# EAGLE design Brake (EAGLE 6.3)
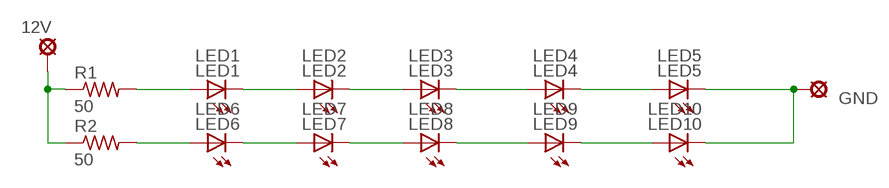
[diagram p0: schematic, sheet 1]

## Parts
12V  LSP13  [LSP13]
GND  LSP13  [LSP13]
LED1  LED1  LED-2AC-CP41B-WES  [CP41B]
LED2  LED2  LED-2AC-CP41B-WES  [CP41B]
LED3  LED3  LED-2AC-CP41B-WES  [CP41B]
LED4  LED4  LED-2AC-CP41B-WES  [CP41B]
LED5  LED5  LED-2AC-CP41B-WES  [CP41B]
LED6  LED6  LED-2AC-CP41B-WES  [CP41B]
LED7  LED7  LED-2AC-CP41B-WES  [CP41B]
LED8  LED8  LED-2AC-CP41B-WES  [CP41B]
LED9  LED9  LED-2AC-CP41B-WES  [CP41B]
LED10  LED10  LED-2AC-CP41B-WES  [CP41B]
R1  50  R-US_R1206  [R1206]
R2  50  R-US_R1206  [R1206]

## Nets
GND: GND.MP LED5.1(C) LED5.4(C) LED10.1(C) LED10.4(C)
N$1: LED1.2(A) LED1.3(A) R1.2
N$2: LED1.1(C) LED1.4(C) LED2.2(A) LED2.3(A)
N$3: LED2.1(C) LED2.4(C) LED3.2(A) LED3.3(A)
N$4: LED3.1(C) LED3.4(C) LED4.2(A) LED4.3(A)
N$5: LED4.1(C) LED4.4(C) LED5.2(A) LED5.3(A)
N$6: LED6.2(A) LED6.3(A) R2.2
N$7: LED6.1(C) LED6.4(C) LED7.2(A) LED7.3(A)
N$8: LED7.1(C) LED7.4(C) LED8.2(A) LED8.3(A)
N$9: 12V.MP R1.1 R2.1
N$10: LED8.1(C) LED8.4(C) LED9.2(A) LED9.3(A)
N$11: LED9.1(C) LED9.4(C) LED10.2(A) LED10.3(A)

## Library data of the parts
12V GND = solpad:LSP13: SOLDER PAD drill 1.3 mm, distributor Buerklin, 12H562
LED1-LED10 = led:LED-2AC-: LEDs with 2 Cathode & 2 Anode - Kingbright SUPER FLUX LED LAMP Source: www.us.kingbright.com/images/catalog/SPEC/W7676CPBC-H.pdf Cree® P4 LED CP41B-WES/WGS Source: Data sheet <http://www.cree.com/products/pdf/LEDlamps/CP41B-WES&WGS.pdf>
R1 R2 = rcl:R-US_: RESISTOR, American symbol

## Board
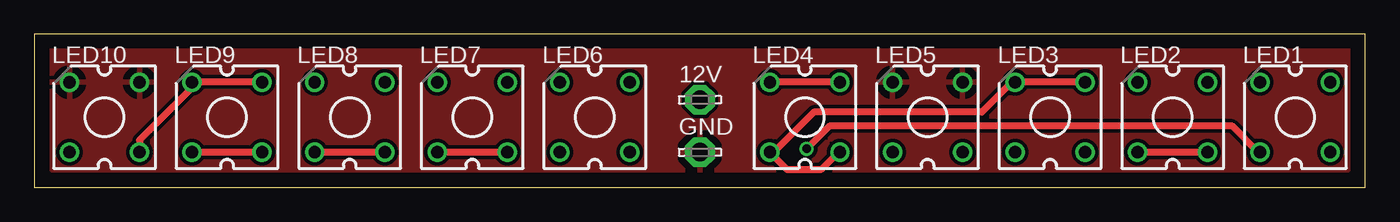
[diagram p1: board, top side]
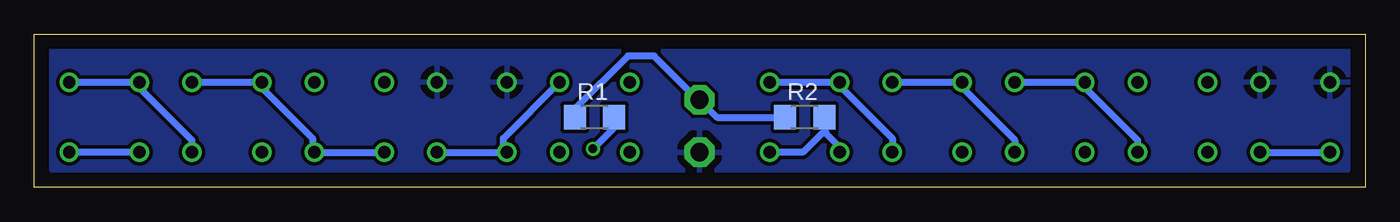
[diagram p2: board, bottom side, seen from below]

Size 96.5 x 11.1 mm. Coordinates in mm from the lower left corner, seen from the top.
Outline: 0,0 96.5,0 96.5,11.1 0,11.1 0,0
Copper layers (1*16): Top 0.035mm / dielectric 1.5mm / Bottom 0.035mm
Design rules "SJ Design Rules *": minimum track width 20mil, minimum drill 24mil, track to track 10mil, track to pad 10mil, pad to pad 10mil, via to via 10mil, smd to smd 10mil, copper to edge 40mil, drill to drill 10mil, minimum pad ring 10mil, minimum via ring 8mil, stop-mask expansion 4mil, vias tented up to drill 0mil, thermal gap 20mil

### Footprints (pad centres in the part's own frame; a part is rotated, then mirrored left to right if it is on the bottom)
LSP13 = drill 1.321 pad 2.159 octagon: MP 0,0
CP41B = drill 0.9 pad 1.27: 1 -2.54,2.54; 2 -2.54,-2.54; 3 2.54,-2.54; 4 2.54,2.54
R1206 = smd 1.6 x 1.803: 1 -1.422,0; 2 1.422,0

### Placement (x,y rotation side)
12V  48.26,6.35 0 top
GND  48.26,2.54 0 top
LED1  91.44,5.08 0 top
LED2  82.55,5.08 0 top
LED3  73.66,5.08 0 top
LED4  55.88,5.08 0 top
LED5  64.77,5.08 0 top
LED6  40.64,5.08 0 top
LED7  31.75,5.08 0 top
LED8  22.86,5.08 0 top
LED9  13.97,5.08 0 top
LED10  5.08,5.08 0 top
R1  55.88,5.08 0 bottom
R2  40.64,5.08 0 bottom

### Tracks (layer width: path | path; a pad name or v marks a point on that pad's centre or on a via)
GND
  pour Top: 1.27,10.16 95.25,10.16 95.25,1.27 1.27,1.27
  pour Bottom: 1.27,10.16 95.25,10.16 95.25,1.27 1.27,1.27
N$1  (via drill 0.61)
  Top 0.508: v56.01,2.79 57.66,4.45 86.87,4.45 88.77,2.54 LED1.2
  Bottom 0.508: v56.01,2.79 54.48,4.32 54.48,5.08 R1.2 | LED1.2 LED1.3
N$2
  Top 0.508: LED2.3 LED2.2
  Bottom 0.508: LED1.4 LED1.1 89.15,7.49 85.09,3.43 LED2.3
N$3
  Bottom 0.508: LED3.2 LED3.3 76.33,2.67 76.33,3.56 80.26,7.49 LED2.1 LED2.4
N$4
  Top 0.508: LED4.3 58.29,2.54 57.02,1.27 54.61,1.27 LED4.2 53.59,2.54 56.52,5.46 68.71,5.46 70.99,7.75 LED3.1 LED3.4
N$5
  Top 0.508: LED4.4 LED4.1
  Bottom 0.508: LED5.3 LED5.2 62.48,2.67 62.48,3.56 LED4.4
N$6
  Bottom 0.508: 39.12,4.06 39.12,3.94 38.1,2.92 LED6.2 | 39.12,4.06 39.12,5.08 R2.2 | LED6.3 40.77,2.54 39.24,4.06 39.12,4.06
N$7
  Top 0.508: LED7.3 LED7.2
  Bottom 0.508: LED6.4 LED6.1 38.23,7.49 34.29,3.56 LED7.3
N$8
  Top 0.508: LED8.3 LED8.2
  Bottom 0.508: LED7.4 LED7.1 29.46,7.49 25.4,3.43 LED8.3
N$9
  Bottom 0.508: R2.1 46.99,5.08 12V.MP 48.39,6.35 51.56,9.53 53.47,9.53 57.28,5.71 57.28,5.08 R1.1
N$10
  Top 0.508: LED9.3 LED9.2
  Bottom 0.508: LED8.4 LED8.1 20.57,7.49 16.51,3.43 LED9.3
N$11
  Top 0.508: LED9.4 LED9.1 11.68,7.49 7.62,3.43 LED10.3
  Bottom 0.508: LED10.3 LED10.2